# EAGLE design Schematic (EAGLE 9.6.2)
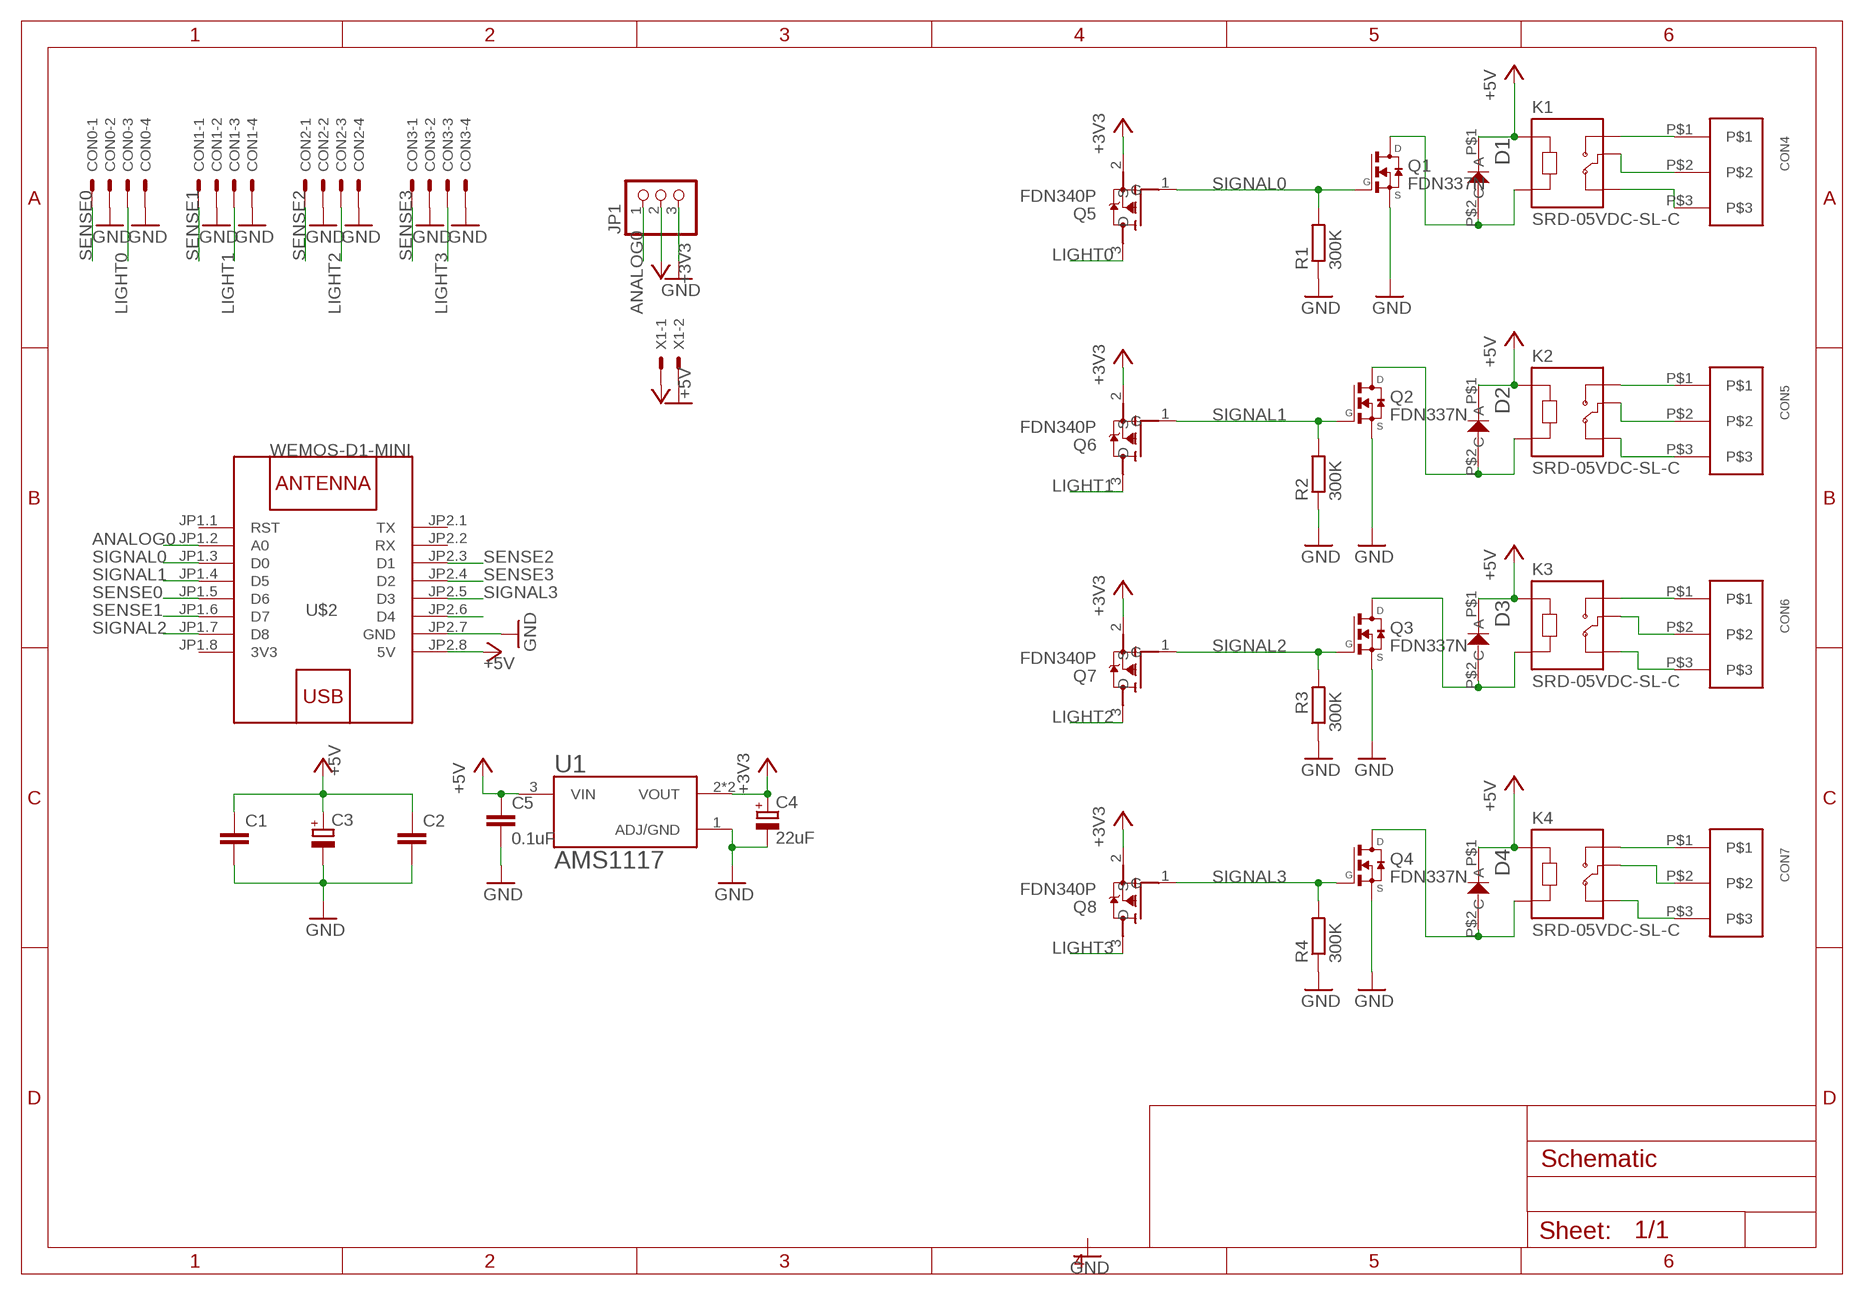
[diagram p0: schematic, sheet 1]

## Parts
C1  C-EUC0603  [C0603]
C2  C-EUC0603  [C0603]
C3  CPOL-EUB  [PANASONIC_B]
C4  22uF  CPOL-EUC/6032-28R  [C/6032-28R]
C5  0.1uF  C-EUC0603  [C0603]
CON0  JST-XH-04-PIN-LONG-PAD  [JST-XH-04-PACKAGE-LONG-PAD]
CON1  JST-XH-04-PIN-LONG-PAD  [JST-XH-04-PACKAGE-LONG-PAD]
CON2  JST-XH-04-PIN-LONG-PAD  [JST-XH-04-PACKAGE-LONG-PAD]
CON3  JST-XH-04-PIN-LONG-PAD  [JST-XH-04-PACKAGE-LONG-PAD]
CON4  KF-301-3P  [STD]
CON5  KF-301-3P  [STD]
CON6  KF-301-3P  [STD]
CON7  KF-301-3P  [STD]
D1  M7  [M7]
D2  M7  [M7]
D3  M7  [M7]
D4  M7  [M7]
JP1  PINHD-1X3  [1X03]
K1  SRD-05VDC-SL-C  [RELAY_SRD-05VDC-SL-C]
K2  SRD-05VDC-SL-C  [RELAY_SRD-05VDC-SL-C]
K3  SRD-05VDC-SL-C  [RELAY_SRD-05VDC-SL-C]
K4  SRD-05VDC-SL-C  [RELAY_SRD-05VDC-SL-C]
Q1  FDN337N  [SSOT-3]
Q2  FDN337N  [SSOT-3]
Q3  FDN337N  [SSOT-3]
Q4  FDN337N  [SSOT-3]
Q5  FDN340P  [SOT95P240X120-3N]
Q6  FDN340P  [SOT95P240X120-3N]
Q7  FDN340P  [SOT95P240X120-3N]
Q8  FDN340P  [SOT95P240X120-3N]
R1  300K  R-EU_R1206  [R1206]
R2  300K  R-EU_R1206  [R1206]
R3  300K  R-EU_R1206  [R1206]
R4  300K  R-EU_R1206  [R1206]
U1  AMS1117  [SOT229P700X180-4N]
U$2  WEMOS-D1-MINI  [WEMOS-D1-MINI]
X1  JST-XH-02-PIN-LONG-PAD  [JST-XH-02-PACKAGE-LONG-PAD]

## Nets
+3V3 [Power Rails]: C4.+ JP1.2 Q5.2(S) Q6.2(S) Q7.2(S) Q8.2(S) U1.2(VOUT) U1.4(VOUT)
+5V [Power Rails]: C1.1 C2.1 C3.+ C5.1 D1.P$1(C) D2.P$1(C) D3.P$1(C) D4.P$1(C) K1.A1 K2.A1 K3.A1 K4.A1 U1.3(VIN) U$2.JP2.8(5V) X1.1
ANALOG0: JP1.1 U$2.JP1.2(A0)
GND [Power Rails]: C1.2 C2.2 C3.- C4.- C5.2 CON0.2 CON0.4 CON1.2 CON1.4 CON2.2 CON2.4 CON3.2 CON3.4 JP1.3 Q1.2(S) Q2.2(S) Q3.2(S) Q4.2(S) R1.1 R2.1 R3.1 R4.1 U1.1(ADJ/GND) U$2.JP2.7(GND) X1.2
LIGHT0: CON0.3 Q5.3(D)
LIGHT1: CON1.3 Q6.3(D)
LIGHT2: CON2.3 Q7.3(D)
LIGHT3: CON3.3 Q8.3(D)
N$1: CON5.P$2 K2.COM
N$2: CON4.P$1 K1.NO
N$3: CON4.P$2 K1.COM
N$4: D1.P$2(A) K1.A2 Q1.3(D)
N$5: CON4.P$3 K1.NC
N$6: D2.P$2(A) K2.A2 Q2.3(D)
N$11: CON5.P$3 K2.NC
N$12: CON5.P$1 K2.NO
N$13: CON6.P$1 K3.NO
N$14: CON6.P$2 K3.COM
N$15: CON6.P$3 K3.NC
N$16: CON7.P$1 K4.NO
N$17: CON7.P$2 K4.COM
N$18: CON7.P$3 K4.NC
N$21: U$2.JP2.6(D4)
N$23: D4.P$2(A) K4.A2 Q4.3(D)
N$26: D3.P$2(A) K3.A2 Q3.3(D)
SENSE0: CON0.1 U$2.JP1.5(D6)
SENSE1: CON1.1 U$2.JP1.6(D7)
SENSE2: CON2.1 U$2.JP2.3(D1)
SENSE3: CON3.1 U$2.JP2.4(D2)
SIGNAL0: Q1.1(G) Q5.1(G) R1.2 U$2.JP1.3(D0)
SIGNAL1: Q2.1(G) Q6.1(G) R2.2 U$2.JP1.4(D5)
SIGNAL2: Q3.1(G) Q7.1(G) R3.2 U$2.JP1.7(D8)
SIGNAL3: Q4.1(G) Q8.1(G) R4.2 U$2.JP2.5(D3)
Unconnected: U$2.JP1.1(RST) U$2.JP2.1(TX) U$2.JP2.2(RX)

## Power pins joined to a net without a drawn wire
3V3: U$2.JP1.8(3V3)

## Library data of the parts
C1 C2 C5 = rcl:C-EU: CAPACITOR, European symbol; SPICEPREFIX: C
C3 C4 = rcl:CPOL-EU: POLARIZED CAPACITOR, European symbol; SPICEPREFIX: C
CON0 CON1-CON3 = Rembrandt Electronics - JST XH Connectors v1-0:JST-XH-04-PIN: JST XH Connector 2 Pin Wire to board connector. Pitch: 2,54 mm, (0.100") Number of pins: 4 Created by Rembrandt Electronics www.rembrandtelectronics.com
CON4-CON7 = KF301:KF-301-3P: KF-301-3P Library This library models the KF-301-3P terminal block that is often used in DIY electronics projects. Made by Ethan Chua on 5.4.21 Feel free to share and use.
D1-D4 = M7 (1N4007):M7: M7 Diode SMT version of the popular 1N4007 diode.
JP1 = adafruit:PINHD-1X3: PIN HEADER
K1-K4 = SRD-05VDC-SL-C:SRD-05VDC-SL-C: 5V Trigger Relay Module For Arduino And Raspberry Pi 5V Trigger Relay Module For Arduino And Raspberry Pi; AVAILABILITY: Unavailable; DESCRIPTION: 5V Trigger Relay Module For Arduino And Raspberry Pi 5V Trigger Relay Module For Arduino And Raspberry Pi; MF: Songle Relay; MP: SRD-05VDC-SL-C; PACKAGE: None; PRICE: None
Q1-Q4 = FDN337N:FDN337N: N-Channel MOSFET Logic Level Enhancement Mode Field Effect Transistor Check prices <https://pricing.snapeda.com/parts/FDN337N/ON%20Semiconductor/view-part?ref=eda>; AVAILABILITY: In Stock; DESCRIPTION: FDN337 Series 30 V 65 mOhm N-Ch Field Effect Transistor - SSOT-3; MF: ON Semiconductor; MP: FDN337N; PACKAGE: TO-236-3 ON; PRICE: None; PURCHASE-URL: https://pricing.snapeda.com/search/part/FDN337N/?ref=eda
Q5-Q8 = FDN340P:FDN340P: FDN340P Series 20V 70 mOhm Single P-Ch Logic Level PowerTrench Mosfet SSOT-3 Check prices <https://pricing.snapeda.com/parts/FDN340P/ON%20Semiconductor/view-part?ref=eda>; AVAILABILITY: In Stock; DESCRIPTION: P-Channel 20V 2A (Ta) 500mW (Ta) Surface Mount SuperSOT-3; MF: ON Semiconductor; MP: FDN340P; PACKAGE: TO-236-3 ON; PRICE: None; PURCHASE-URL: https://pricing.snapeda.com/search/part/FDN340P/?ref=eda
R1-R4 = rcl:R-EU_: RESISTOR, European symbol; SPICEPREFIX: R
U1 = AMS1117:AMS1117: Sot223/Pkg 1-Amp 5-Volt Low Drop Out Voltage Regulatator Check prices <https://pricing.snapeda.com/parts/AMS1117/Advanced%20Monolithic%20Systems/view-part?ref=eda>; AVAILABILITY: In Stock; DESCRIPTION: 1A LOW DROPOUT VOLTAGE REGULATOR SOT-223; MF: Advanced Monolithic Systems; MP: AMS1117; PACKAGE: SOT-223 Seeed Technology; PRICE: None
U$2 = diy-modules:WEMOS-D1-MINI: WEMOS D1 mini: Mini Wi-Fi Board based on ESP-8266 device More details can be found here: https://www.wemos.cc/product/d1-mini.html Click here to find device on ebay.com <http://www.ebay.com/sch/wemos+d1+mini+nodemcu>
X1 = Rembrandt Electronics - JST XH Connectors v1-0:JST-XH-02-PIN: JST XH Connector 2 Pin Wire to board connector. Pitch: 2,54 mm, (0.100") Number of pins: 2 Created by Rembrandt Electronics www.rembrandtelectronics.com

## Net classes
1 Power Rails: width 0.305 mm

## Board
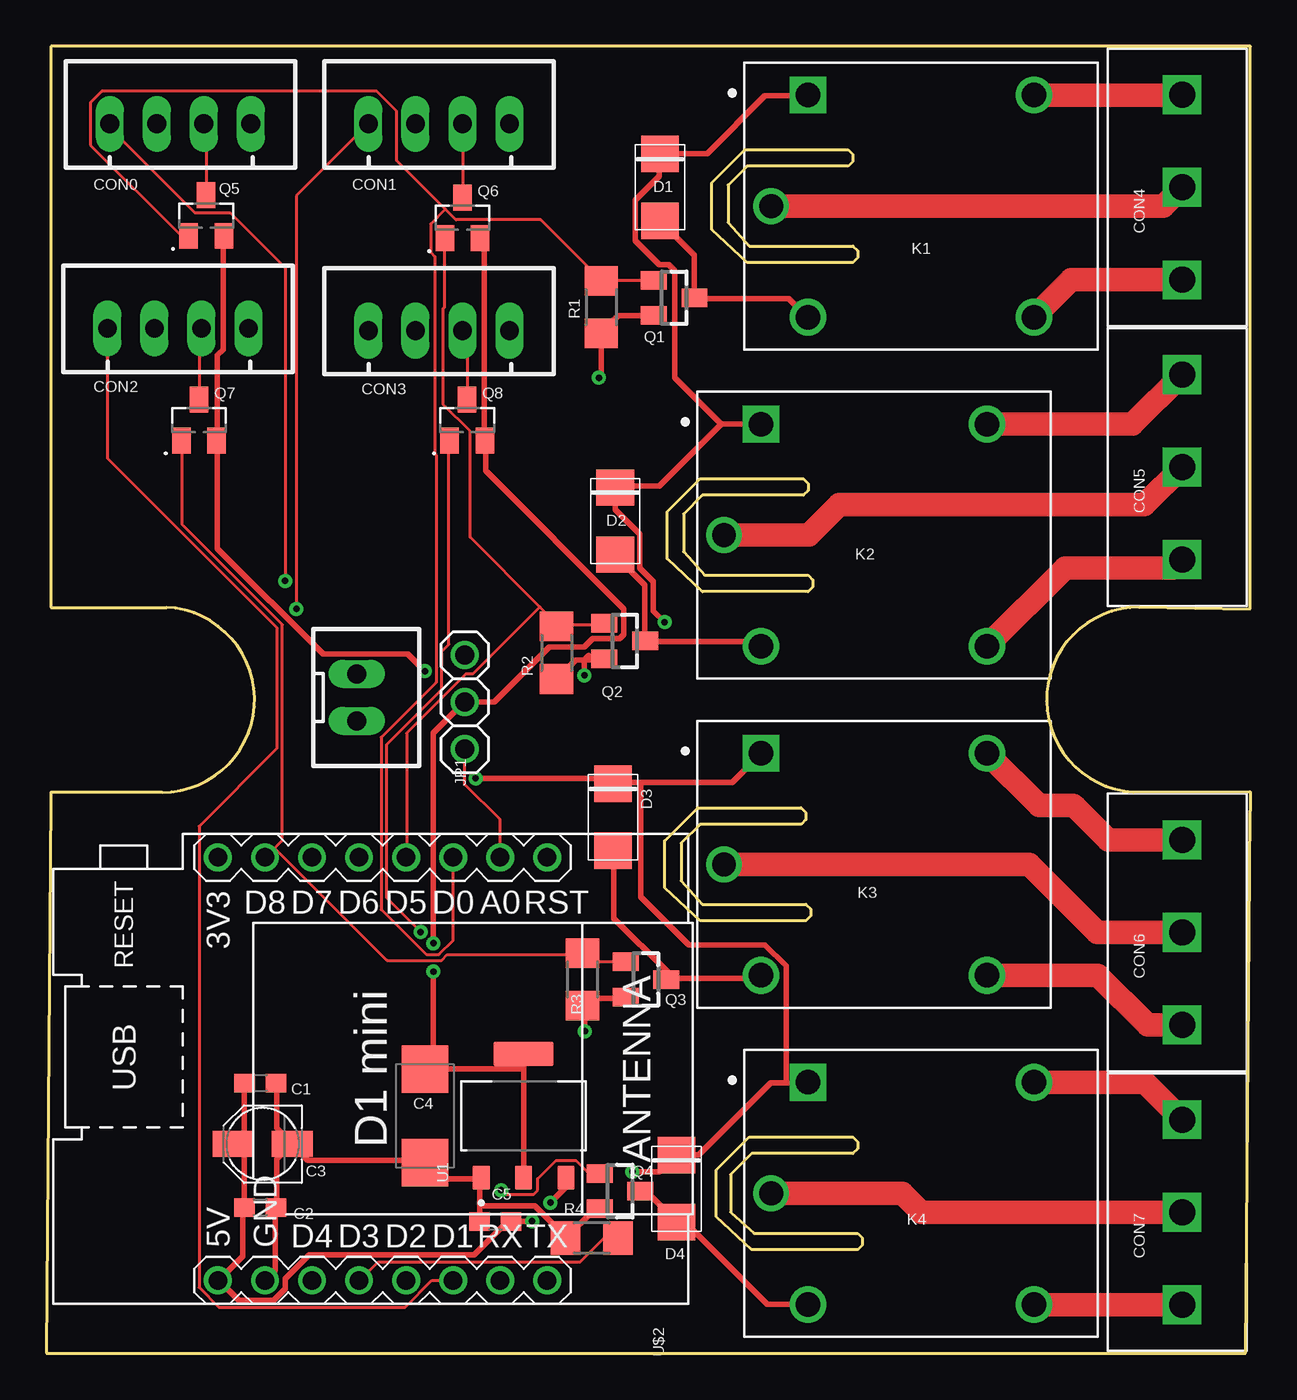
[diagram p1: board, top side]
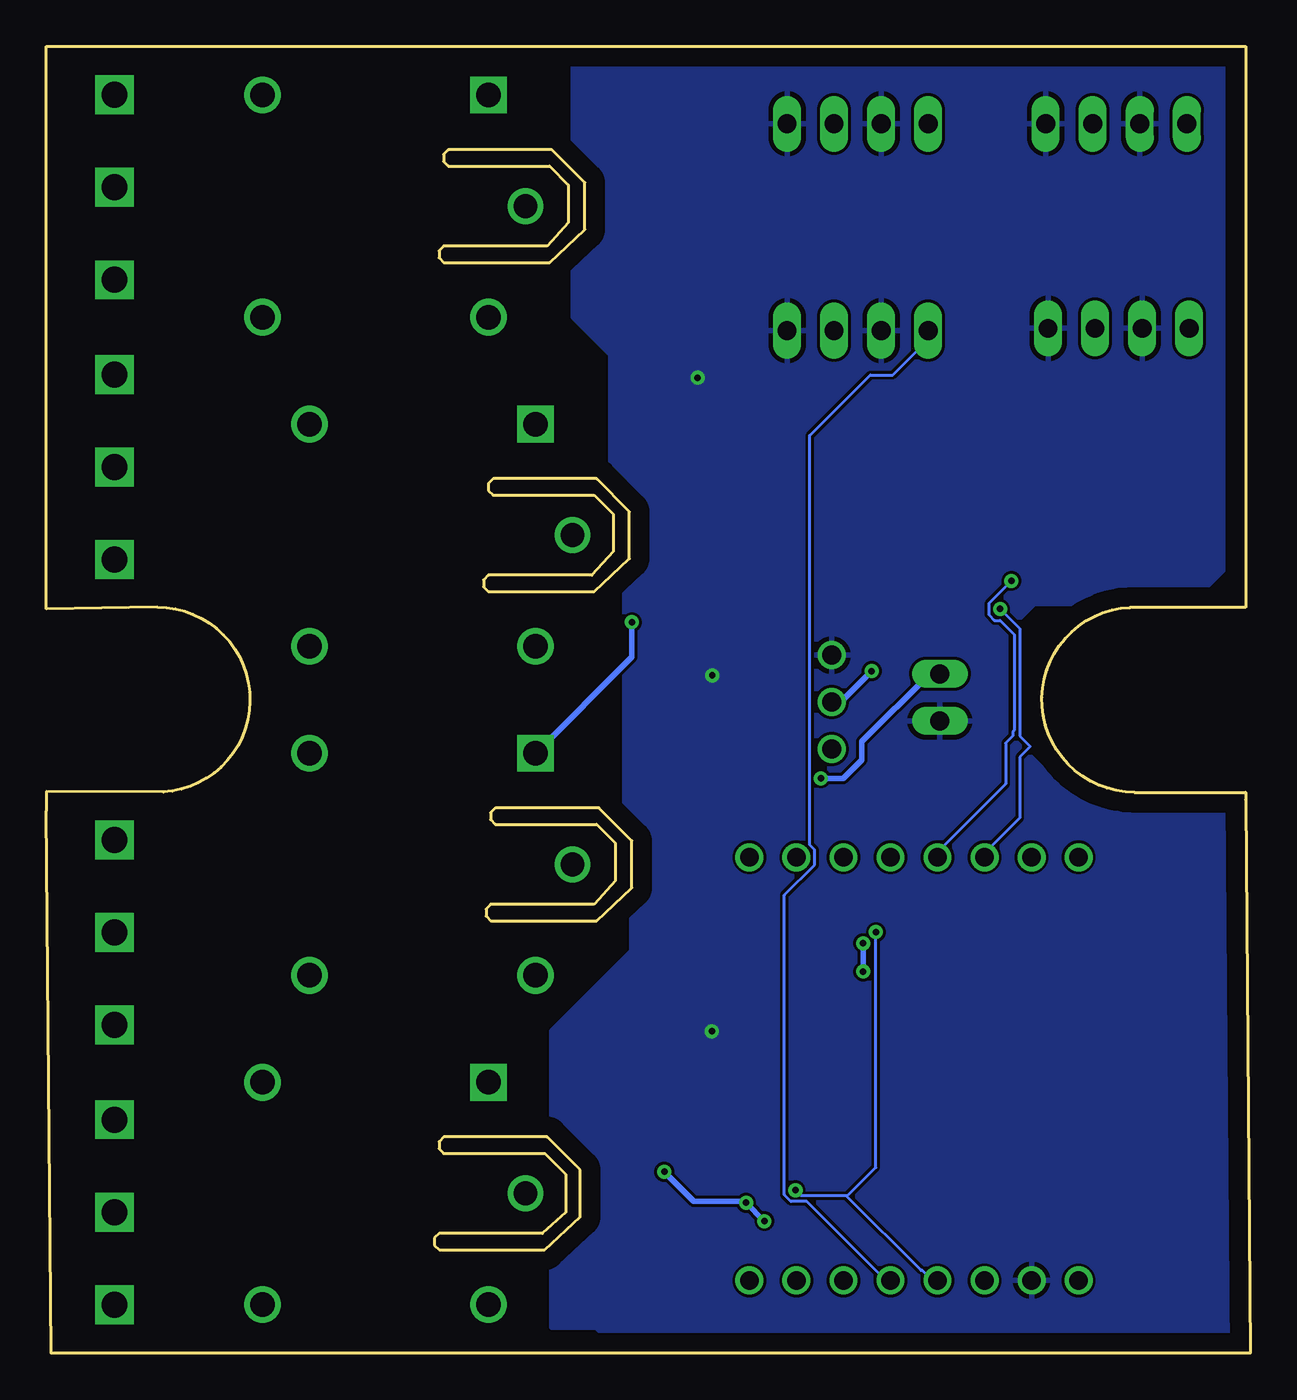
[diagram p2: board, bottom side, seen from below]

Size 65.03 x 70.61 mm. Coordinates in mm from the lower left corner, seen from the top.
Outline: 35.94,60.71 35.94,63.25 37.72,65.02 43.31,65.02 43.56,64.77 43.56,64.39 43.31,64.13 37.85,64.13 36.83,63.12 36.83,61.09 37.97,59.82 43.56,59.82 43.81,59.56 43.81,59.18 43.56,58.93 37.85,58.93 35.94,60.71
Outline: 33.53,42.93 33.53,45.47 35.31,47.24 40.89,47.24 41.15,46.99 41.15,46.61 40.89,46.36 35.43,46.36 34.42,45.34 34.42,43.31 35.56,42.04 41.15,42.04 41.4,41.78 41.4,41.4 41.15,41.15 35.43,41.15 33.53,42.93
Outline: 33.4,25.15 33.4,27.69 35.18,29.46 40.77,29.46 41.02,29.21 41.02,28.83 40.77,28.57 35.31,28.57 34.29,27.56 34.29,25.53 35.43,24.26 41.02,24.26 41.27,24 41.27,23.62 41.02,23.37 35.31,23.37 33.4,25.15
Outline: 38.1,10.79 36.96,9.65 36.96,7.62 38.23,6.48 43.81,6.48 44.07,6.22 44.07,5.84 43.81,5.59 38.1,5.59 36.2,7.37 36.2,9.91 37.97,11.68 43.56,11.68 43.81,11.43 43.81,11.05 43.56,10.79 38.1,10.79
Outline: 6.25,30.31 0.25,30.31 0.25,29.9 0,0 64.77,0 65.02,29.31 65.02,30.34 58.71,30.32 arc-176 59.02,40.31 65.02,40.22 65.03,70.61 0.25,70.61 0.25,40.3 6.49,40.3 arc-177 6.25,30.31
Copper layers (1*16): Top 0.035mm / dielectric 1.5mm / Bottom 0.035mm
Design rules "default": minimum track width 6mil, minimum drill 0.35mm, track to track 6mil, track to pad 6mil, pad to pad 6mil, via to via 6mil, smd to smd 6mil, copper to edge 40mil, drill to drill 6mil, minimum pad ring 10mil, minimum via ring 8mil, stop-mask expansion 4mil, vias tented up to drill 0mil, thermal gap 10mil

### Footprints (pad centres in the part's own frame; a part is rotated, then mirrored left to right if it is on the bottom)
C0603 = smd 1.1 x 1: 1 -0.85,0; 2 0.85,0
PANASONIC_B = smd 2.2 x 1.4: + 1.6,0; - -1.6,0
C/6032-28R = smd 2.55 x 2.5: + 2.525,0; - -2.525,0
JST-XH-04-PACKAGE-LONG-PAD = drill 1.016 long: 1 -3.81,0; 2 -1.27,0; 3 1.27,0; 4 3.81,0
STD = drill 1.4 square: P$1 -5,0; P$2 0,0; P$3 5,0
M7 = smd 1.96 x 2.04: P$1 -1.81,0; P$2 1.81,0
1X03 = drill 1.016: 1 -2.54,0; 2 0,0; 3 2.54,0
RELAY_SRD-05VDC-SL-C = drill 1.32 square: A1 -6.1,6 | drill 1.32: A2 -6.1,-6; NC 6.1,6; NO 6.1,-6 | drill 1.29: COM -8.1,0
SSOT-3 = smd 1 x 1.4: 1 -0.95,-1.1; 2 0.95,-1.1; 3 0,1.1
SOT95P240X120-3N = smd 1.4 x 1: 1 -1.1,0.95; 2 -1.1,-0.95; 3 1.1,0
R1206 = smd 1.6 x 1.803: 1 -1.422,0; 2 1.422,0
SOT229P700X180-4N = smd 1.31 x 0.93: 1 -3.345,2.29; 2 -3.345,0; 3 -3.345,-2.29 | smd 1.31 x 3.24: 4 3.345,0
WEMOS-D1-MINI = drill 1: JP1.1 -11.43,9.525; JP1.2 -11.43,6.985; JP1.3 -11.43,4.445; JP1.4 -11.43,1.905; JP1.5 -11.43,-0.635; JP1.6 -11.43,-3.175; JP1.7 -11.43,-5.715; JP1.8 -11.43,-8.255; JP2.1 11.43,9.525; JP2.2 11.43,6.985; JP2.3 11.43,4.445; JP2.4 11.43,1.905; JP2.5 11.43,-0.635; JP2.6 11.43,-3.175; JP2.7 11.43,-5.715; JP2.8 11.43,-8.255
JST-XH-02-PACKAGE-LONG-PAD = drill 1.016 long: 1 -1.27,0; 2 1.27,0

### Placement (x,y rotation side)
C1  11.56,14.61 0 top
C2  11.56,7.87 0 top
C3  11.68,11.3 180 top
C4  20.45,12.83 90 top
C5  24.26,7.11 180 top
CON0  7.24,66.42 0 top
CON1  21.21,66.42 0 top
CON2  7.11,55.37 0 top
CON3  21.21,55.25 0 top
CON4  61.34,62.99 90 top
CON5  61.34,47.88 90 top
CON6  61.34,22.73 90 top
CON7  61.34,7.62 90 top
D1  33.15,62.99 270 top
D2  30.73,44.96 270 top
D3  30.61,28.96 270 top
D4  34.04,8.89 270 top
JP1  22.61,35.18 90 top
K1  47.24,61.98 0 top
K2  44.7,44.2 0 top
K3  44.7,26.42 0 top
K4  47.24,8.64 0 top
Q1  33.91,57.02 270 top
Q2  31.24,38.48 270 top
Q3  32.38,20.19 270 top
Q4  30.99,8.76 270 top
Q5  8.64,61.47 90 top
Q6  22.48,61.34 90 top
Q7  8.25,50.42 90 top
Q8  22.73,50.42 90 top
R1  29.97,56.52 90 top
R2  27.56,37.85 90 top
R3  28.96,20.19 90 top
R4  29.46,6.22 0 top
U1  25.78,12.83 90 top
U$2  17.53,15.37 270 top
X1  16.76,35.43 270 top

### Tracks (layer width: path | path; a pad name or v marks a point on that pad's centre or on a via)
+3V3  (via drill 0.35)
  Top 0.305: U1.4 25.78,15.37 | 25.78,15.37 U1.2 | 25.78,15.37 20.45,15.37 C4.+ 20.9,15.44 v20.9,20.62 | Q5.2 9.55,60.33 9.55,54.23 9.25,53.92 9.25,49.35 Q7.2 9.25,49.2 9.25,43.48 14.96,37.77 19.53,37.77 v20.45,36.86 | Q6.2 23.5,60.17 23.65,60.02 23.65,49.35 Q8.2 23.72,49.2 23.72,47.68 31.19,40.21 31.19,38.84 30.96,38.61 29.52,38.61 29.06,38.15 27.15,38.15 24.18,35.18 JP1.2 22.5,35.1 20.9,33.5 v20.9,22.15
  Bottom 0.305: v20.45,36.86 22.12,35.18 JP1.2 | v20.9,22.15 v20.9,20.62
+5V  (via drill 0.35)
  Top 0.305: K1.A1 41.1,67.94 38.81,67.94 35.69,64.82 33.17,64.82 D1.P$1 33.1,64.67 33.1,63.6 31.8,62.31 31.8,60.1 33.1,58.8 33.63,58.8 33.93,58.5 33.93,52.71 36.45,50.19 | 36.45,50.19 33.1,46.84 30.73,46.84 D2.P$1 30.73,45.58 32.06,44.25 32.06,42.43 32.79,41.69 32.79,40.11 v33.4,39.5 | 36.45,50.19 38.58,50.19 K2.A1 | C1.1 10.69,11.94 10.16,11.41 C3.+ 10.16,11.25 10.69,10.72 10.69,7.9 C2.1 10.62,7.75 10.62,5.23 9.4,4.01 U$2.JP2.8 9.32,3.94 10.39,2.87 12.29,2.87 12.9,3.48 12.9,4.01 14.2,5.31 23.11,5.31 24.87,7.06 25.1,7.06 C5.1 25.25,7.14 v26.24,7.14 | v27.23,8.13 28.07,8.97 28.07,9.42 U1.3 | 39.95,14.61 41.1,14.61 K4.A1 | 39.95,14.61 39.12,14.61 35.23,10.72 34.09,10.72 D4.P$1 33.93,10.64 33.1,9.8 v31.65,9.8 | 32.11,30.84 37.06,30.84 38.58,32.36 K3.A1 | 32.11,30.84 30.66,30.84 D3.P$1 30.51,30.84 30.28,31.06 v23.19,31.06 | 39.95,14.61 39.95,20.93 38.81,22.07 34.7,22.07 32.11,24.66 32.11,30.84
  Bottom 0.305: v26.24,7.14 v27.23,8.13 27.3,8.2 30.05,8.2 v31.65,9.8 | X1.1 17.32,36.7 20.98,33.05 20.98,32.05 21.97,31.06 v23.19,31.06 | v33.4,39.5 33.4,37.62 K3.A1
ANALOG0
  Top 0.152: U$2.JP1.2 24.49,26.8 24.49,28.85 22.58,30.76 22.58,32.59 JP1.1
GND  (via drill 0.35)
  Top 0.305: 23.42,7.98 23.42,9.42 U1.1 23.27,9.42 21.29,9.42 20.45,10.26 C4.- 20.37,10.41 14.12,10.41 13.36,11.18 C3.- | 23.42,7.98 23.42,7.14 C5.2 | Q4.2 29.82,7.75 29.59,7.75 28.07,6.22 R4.1 28.07,6.3 26.39,7.98 23.42,7.98 | 30.96,19.1 Q3.2 31.27,19.18 29.36,19.18 28.98,18.8 R3.1 29.08,18.64 v29.08,17.4 | C3.- 13.21,11.25 12.45,10.49 12.45,7.9 C2.2 12.37,7.75 12.37,4.47 11.84,3.94 U$2.JP2.7 | C1.2 12.45,14.61 12.45,12.17 13.21,11.41 C3.- | 29.06,37.47 28.6,37.47 27.61,36.47 R2.1 | 29.06,37.47 29.13,37.47 | 29.13,37.47 30.12,37.47 Q2.2 | v29.06,36.63 29.06,37.47 | 29.29,37.69 29.13,37.54 29.13,37.47 | 32.79,55.91 Q1.2 32.79,56.06 30.89,56.06 29.97,55.14 R1.1 29.97,52.83 v29.85,52.71
  pour Bottom: -0.51,70.87 -0.51,44.32 3.3,40.51 11.68,40.51 13.21,38.99 13.21,33.53 10.16,30.48 -0.64,30.48 -0.64,2.54 2.41,-0.51 33.4,-0.51 35.31,1.4 37.72,1.4 37.72,17.4 33.4,21.72 33.4,24.38 32.51,25.27 32.51,27.56 33.78,28.83 33.78,41.66 33.53,41.91 33.53,42.16 32.51,43.18 32.51,45.97 33.78,47.24 34.54,47.24 34.54,53.98 36.58,56.01 36.58,59.31 35.05,60.83 35.05,63.88 36.58,65.41 36.58,69.98 36.32,70.23 36.32,70.87
LIGHT0
  Top 0.152: Q5.3 8.64,66.34 8.56,66.42 CON0.3
LIGHT1
  Top 0.152: Q6.3 22.5,62.46 22.5,66.42 CON1.3
LIGHT2
  Top 0.152: Q7.3 8.25,55.3 8.33,55.37 CON2.3
LIGHT3
  Top 0.152: Q8.3 22.73,54.99 CON3.3
N$1
  Top 1.27: CON5.P$2 59.31,45.85 42.83,45.85 41.18,44.2 K2.COM
N$2
  Top 1.27: K1.NO 55.36,57.99 CON4.P$1
N$3
  Top 1.27: CON4.P$2 60.32,61.98 K1.COM
N$4
  Top 0.152: 35,57.05 Q1.3 35.08,56.97 | 33.17,61.16 D1.P$2 | 41.1,55.98 K1.A2
  Top 0.305: 35,57.05 35,59.33 33.17,61.16 | 35.08,56.97 40.11,56.97 41.1,55.98
N$5
  Top 1.27: K1.NC 61.32,67.98 CON4.P$3
N$6
  Top 0.152: 32.33,38.53 Q2.3 32.41,38.46 | 30.73,43.1 D2.P$2 | 38.58,38.23 K2.A2
  Top 0.305: 32.33,38.53 32.33,41.5 30.73,43.1 | 32.41,38.46 38.35,38.46 38.58,38.23
N$11
  Top 1.27: CON5.P$3 58.66,50.2 K2.NC
N$12
  Top 1.27: CON5.P$1 60.88,42.42 55.03,42.42 K2.NO
N$13
  Top 1.27: CON6.P$1 59.48,17.73 56.8,20.42 K3.NO
N$14
  Top 1.27: CON6.P$2 56.77,22.73 53.09,26.42 K3.COM
N$15
  Top 1.27: K3.NC 53.63,29.59 55.47,29.59 55.58,29.52 57.37,27.73 CON6.P$3
N$16
  Top 1.27: CON7.P$1 53.36,2.62 K4.NO
N$17
  Top 1.27: CON7.P$2 47.24,7.62 46.23,8.64 K4.COM
N$18
  Top 1.27: K4.NC 59.32,14.64 CON7.P$3
N$23
  Top 0.152: 32.41,8.74 32.11,8.74 Q4.3 | 34.01,7.14 D4.P$2 34.09,7.06 34.52,7.06 | 41.1,2.64 K4.A2
  Top 0.305: 34.01,7.14 32.41,8.74 | 34.52,7.06 38.94,2.64 41.1,2.64
N$26
  Top 0.152: 38.43,20.24 38.58,20.4 K3.A2 | 33.55,20.24 Q3.3 33.55,20.32 33.55,20.6 | 30.66,27.1 D3.P$2
  Top 0.305: 38.43,20.24 33.55,20.24 | 30.66,27.1 30.66,23.49 33.55,20.6
SENSE0  (via drill 0.35)
  Top 0.152: v12.9,41.73 12.9,58.65 9.93,61.62 8.03,61.62 3.45,66.19 3.45,66.42 CON0.1
  Bottom 0.152: v12.9,41.73 14.12,40.51 14.12,39.9 13.82,39.6 13.51,39.6 12.75,38.84 12.75,33.66 12.83,33.58 12.83,33.35 13.21,32.97 13.21,30.76 16.87,27.1 16.87,26.8 U$2.JP1.5
SENSE1  (via drill 0.35)
  Top 0.152: v13.51,40.21 13.51,62.54 CON1.1
  Bottom 0.152: U$2.JP1.6 14.35,27.03 12.45,28.93 12.45,32.21 11.91,32.74 11.91,32.82 12.45,33.35 12.45,39.14 v13.51,40.21
SENSE2
  Top 0.152: U$2.JP2.3 20.83,3.94 19.38,2.49 9.32,2.49 8.25,3.56 8.25,28.47 12.45,32.66 12.45,39.22 3.3,48.36 CON2.1
SENSE3
  Bottom 0.152: U$2.JP2.4 19.69,3.94 23.95,8.2 24.81,8.2 25.17,8.56 25.17,24.75 23.53,26.39 23.53,27.2 23.8,27.47 23.8,49.58 20.52,52.86 19.3,52.86 17.4,54.76 CON3.1
SIGNAL0
  Top 0.152: 21.55,61.81 22.12,61.24 26.7,61.24 29.97,57.96 | 21.55,61.81 18.92,64.44 18.92,67.11 17.86,68.17 3,68.17 2.39,67.56 2.39,65.28 7.26,60.4 7.64,60.4 Q5.1 | 29.97,57.96 32.79,57.96 Q1.1 | 29.97,57.96 R1.2 | U$2.JP1.3 21.97,22.3 21.21,21.54 20.52,21.54 18.09,23.98 18.09,33.27 21.06,36.25 21.06,48.51 20.98,48.59 20.98,59.26 20.75,59.49 20.75,61.01 21.55,61.81
SIGNAL1
  Top 0.152: Q2.1 30.12,39.37 27.69,39.37 27.61,39.29 R2.2 27.61,39.37 26.66,40.32 | 26.66,40.32 22.89,44.09 22.89,49.81 21.44,51.26 21.44,56.44 21.51,56.52 21.51,60.17 Q6.1 | 26.66,40.32 23.04,36.7 22.66,36.7 19.46,33.5 19.46,26.8 U$2.JP1.4
SIGNAL2
  Top 0.152: Q3.1 31.27,21.16 29.36,21.16 28.98,21.54 R3.2 28.91,21.54 21.67,21.54 21.36,21.23 18.39,21.23 12.37,27.25 U$2.JP1.7 11.84,26.8 12.75,27.71 12.75,39.37 7.34,44.78 7.34,49.28 Q7.1
SIGNAL3  (via drill 0.35)
  Top 0.152: v24.56,8.81 24.79,8.59 26.31,8.59 26.54,8.81 26.54,9.42 27.53,10.41 28.6,10.41 29.29,9.73 29.82,9.73 Q4.1 | v20.22,22.76 18.39,24.59 18.39,32.89 21.36,35.87 21.36,37.92 21.74,38.3 21.74,49.28 Q8.1 | R4.2 30.12,6.22 28.83,4.93 17.93,4.93 16.94,3.94 U$2.JP2.5
  Bottom 0.152: v24.56,8.81 24.26,8.51 21.82,8.51 21.78,8.47 | 21.78,8.47 17.78,4.47 17.7,4.47 17.17,3.94 U$2.JP2.5 | v20.22,22.76 20.22,10.03 21.78,8.47